# EAGLE design TinyGlo (EAGLE 6.5.0)
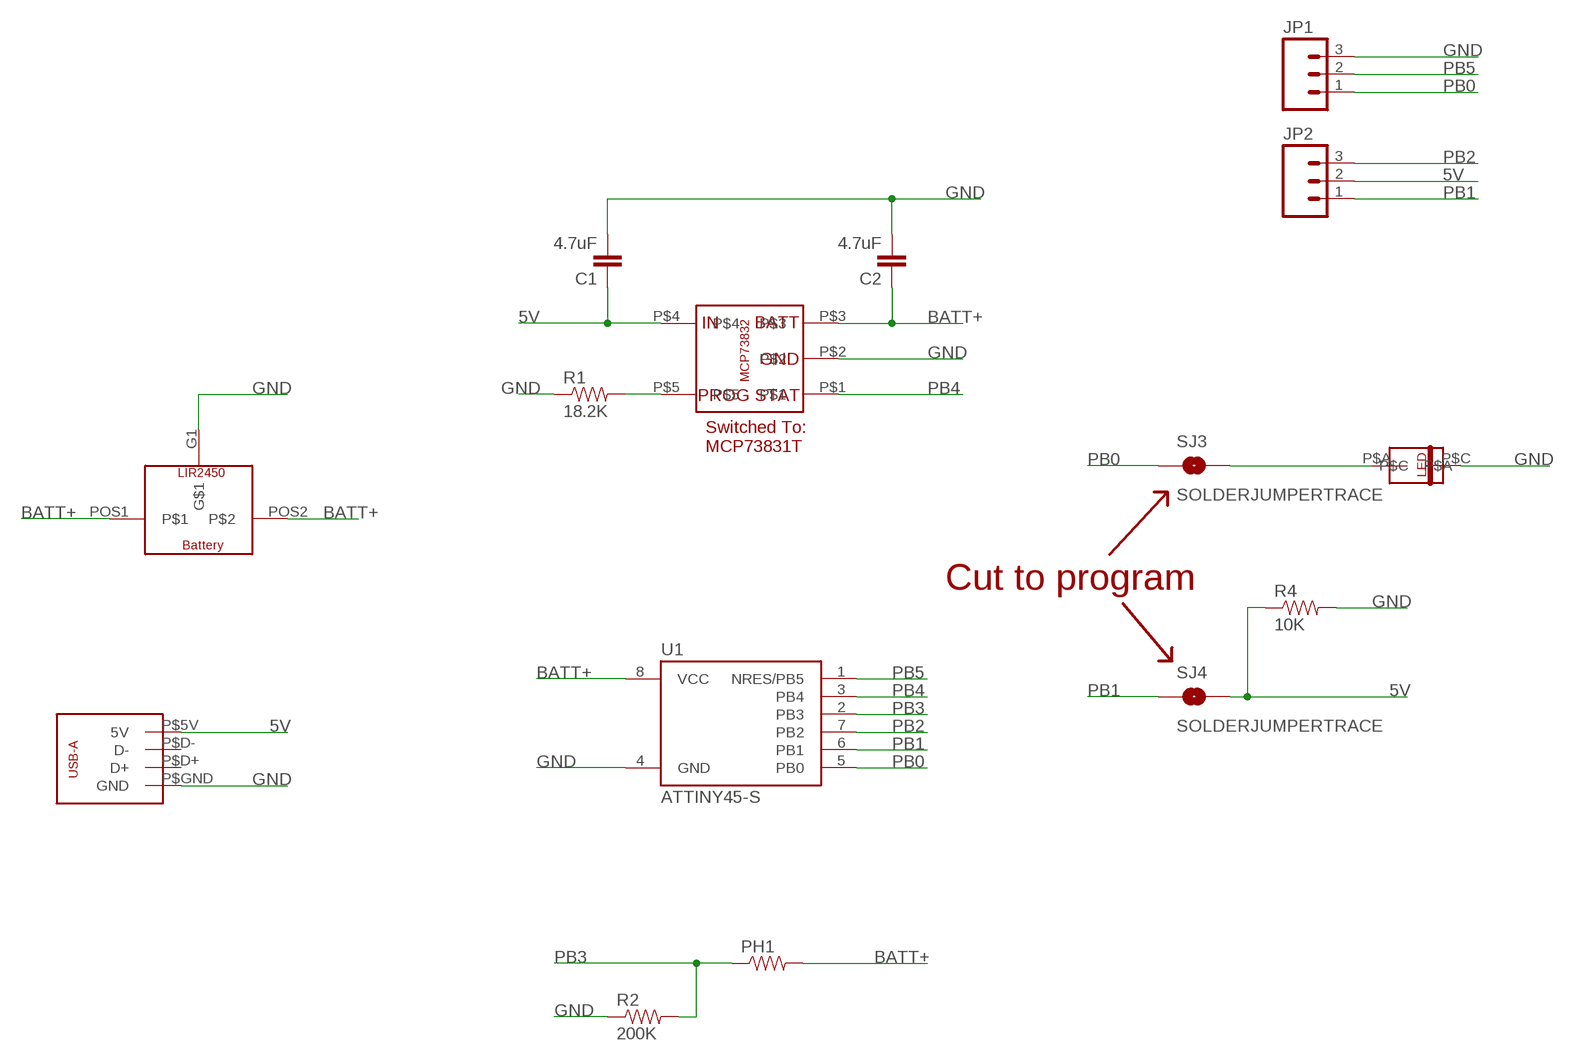
[diagram p0: schematic, sheet 1]

## Parts
C1  4.7uF  CAP0603-CAP  [0603-CAP]
C2  4.7uF  CAP0603-CAP  [0603-CAP]
JP1  M03LOCK  [1X03_LOCK]
JP2  M03LOCK  [1X03_LOCK]
PH1  RESISTOR0805-RES  [0805]
R1  18.2K  RESISTOR0603-RES  [0603-RES]
R2  200K  RESISTOR0603-RES  [0603-RES]
R4  10K  RESISTOR0603-RES  [0603-RES]
SJ3  SOLDERJUMPERTRACE  [SJ_2S-TRACE]
SJ4  SOLDERJUMPERTRACE  [SJ_2S-TRACE]
U1  ATTINY45-S  [SOIC8_EIAJ_208MIL]
U$1  LIPOBATTCHG-MCP73832T-2DFI/OT  [LIPOBATTCHG-MCP73832T-2DFI/OT]
U$2  LIR2450_SMD_BATT_BK-5033  [LIR2450_SMD_BATT_BK-5033]
U$3  USB-A_PCB_TRACES  [USB-A_PCB_TRACES]
U$4  PLCC-2_LED  [PLCC-2_LED]

## Nets
5V: C1.1 JP2.2 R4.1 SJ4.2 U$1.P$4 U$3.P$5V(5V)
BATT+: C2.1 PH1.2 U1.8(VCC) U$1.P$3 U$2.POS1 U$2.POS2
GND: C1.2 C2.2 JP1.3 R1.1 R2.1 R4.2 U1.4(GND) U$1.P$2 U$2.G1(G$1) U$3.P$GND(GND) U$4.P$C
N$1: R1.2 U$1.P$5
N$2: SJ3.2 U$4.P$A
PB0: JP1.1 SJ3.1 U1.5(PB0)
PB1: JP2.1 SJ4.1 U1.6(PB1)
PB2: JP2.3 U1.7(PB2)
PB3: PH1.1 R2.2 U1.2(PB3)
PB4: U1.3(PB4) U$1.P$1
PB5: JP1.2 U1.1(NRES/PB5)
Unconnected: U$3.P$D+(D+) U$3.P$D-(D-)

## Notes on the sheet
- Switched To:
  MCP73831T
- Cut to program

## Library data of the parts
C1 C2 = SparkFun-Capacitors:CAP: Capacitor Standard 0603 ceramic capacitor, and 0.1" leaded capacitor.
JP1 JP2 = SparkFun-Connectors:M03: Header 3 Standard 3-pin 0.1" header. Use with straight break away headers (SKU : PRT-00116), right angle break away headers (PRT-00553), swiss pins (PRT-00743), machine pins (PRT-00117), and female headers (PRT-00115). Molex polarized connector foot print use with SKU : PRT-08232 with associated crimp pins and housings.
PH1 = SparkFun-Resistors:RESISTOR: Resistor Basic schematic elements and footprints for 0603, 1206, and PTH resistors.
R1 R2 R4 = SparkFun-Passives:RESISTOR: Resistor Basic schematic elements and footprints for 0603, 1206, and PTH resistors.
SJ3 SJ4 = SparkFun-Passives:SOLDERJUMPER: Solder Jumper Standard SMD solder jumper. Used to automate production. Two varients : Normally Open and Normally Closed are the same, but have different paste layers. NC will have a large amount of paste and should jumper during reflow.
U1 = _hhn_attiny25_45_85:ATTINY45*: ATMEL ATtiny 45 Packages: P = PDIP 08 30mil S = SOIC 08 EIAJ 208mil X = TSSOP 08 4.4mm Technologies Note: for complete ordering code (temp. range, finish, tape&reel etc.) see www.atmel.com • Supply Voltage: V = (1.8…5.5)V | [blank] = (2.7…5.5)V • Speed: 10 = 10 MHz | 20 = 20 MHz Author: Dipl.-Ing. FH Rainer Bayer HHN Hochschule Heilbronn (Heilbronn University), rainer.bayer@hs-heilbronn.de Ingenieurbüro ing-rb, mail@ing-rb.de
U$1 = JKCustom:LIPOBATTCHG-MCP73832T-2DFI/OT
U$2 = JKCustom:LIR2450_SMD_BATT_BK-5033
U$3 = JKCustom:USB-A_PCB_TRACES
U$4 = JKCustom:PLCC-2_LED

## Board
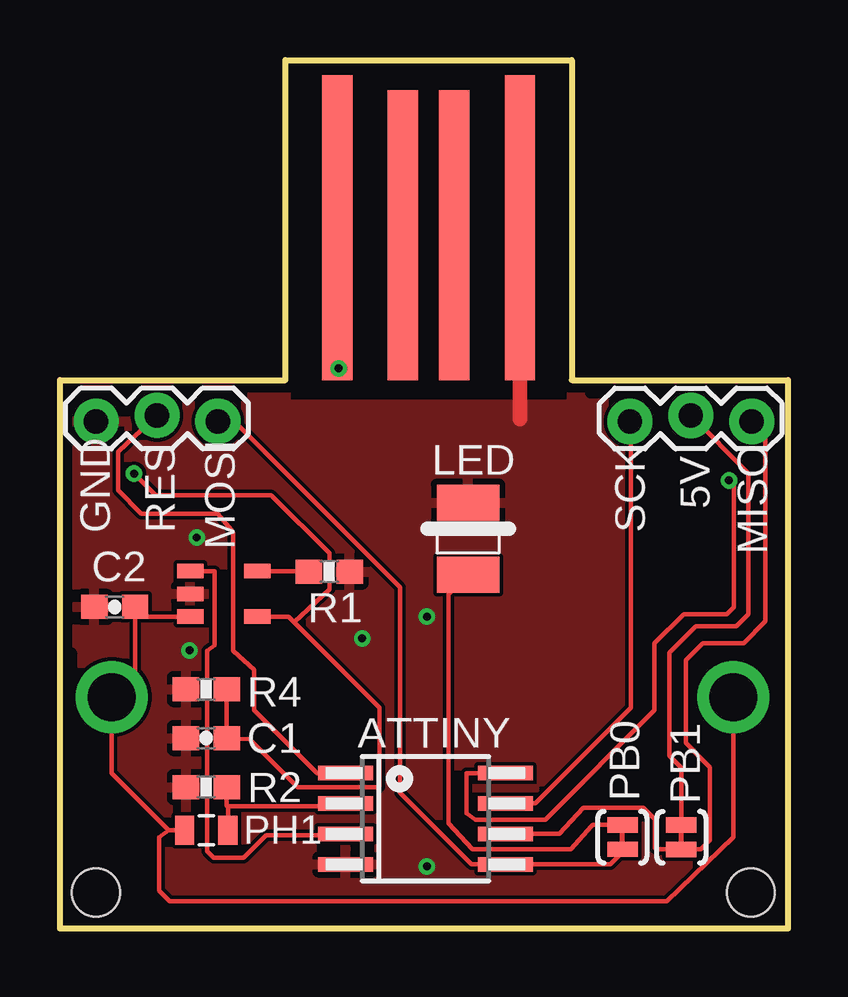
[diagram p1: board, top side]
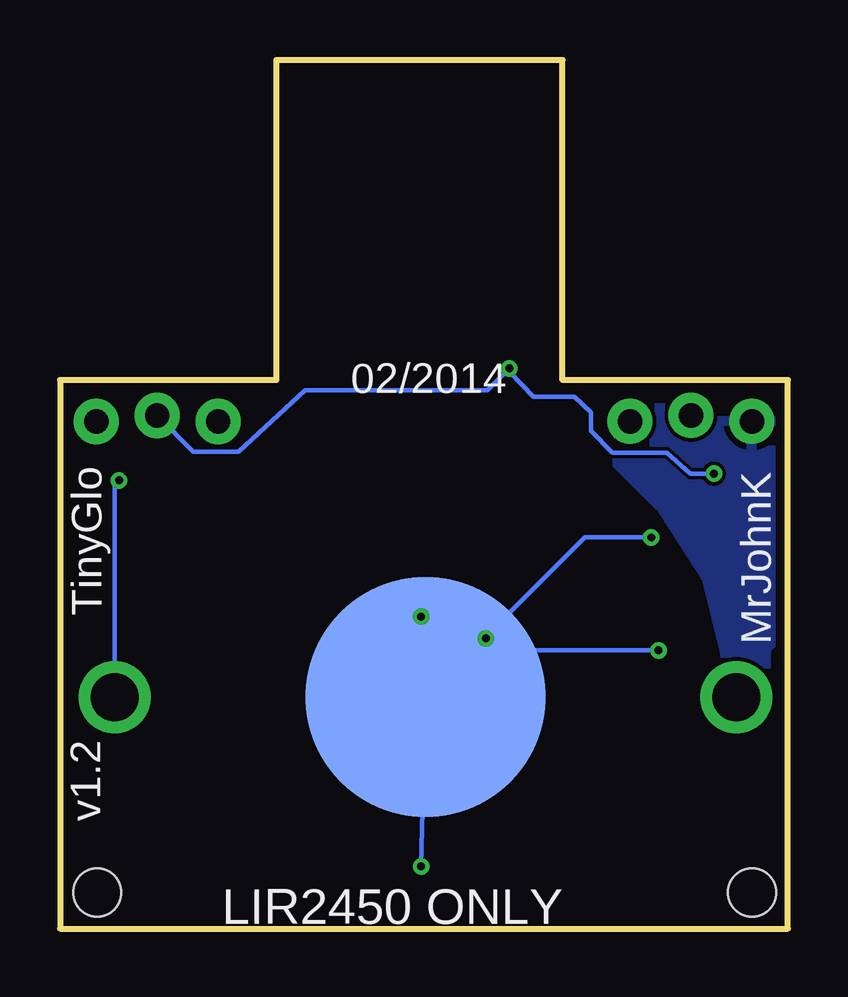
[diagram p2: board, bottom side, seen from below]

Size 30.35 x 36.2 mm. Coordinates in mm from the lower left corner, seen from the top.
Outline: 0,0 0,22.86 9.4,22.86 9.4,36.2 21.34,36.2 21.34,22.86 30.35,22.86 30.35,0 0,0
Copper layers (1*16): Top 0.0356mm / dielectric 1.5011mm / Bottom 0.0356mm
Design rules "LaenPCBOrder_DRC": minimum track width 6mil, minimum drill 13mil, track to track 6mil, track to pad 6mil, pad to pad 6mil, via to via 6mil, smd to smd 6mil, copper to edge 15mil, drill to drill 6mil, minimum pad ring 7mil, minimum via ring 7mil, stop-mask expansion 3mil, vias tented up to drill 0mil, thermal gap 10mil
Holes 2 mm at 1.5,1.5 28.8,1.5
tRestrict: area 29.7,7.5 to 30.3,12.2; area 0,8.4 to 0.5,11.5; area 0,22.2 to 7.6,22.8; area 22.1,22.3 to 30.2,22.8; area 9.5,29.7 to 21.1,36
bRestrict: area 2.8,0.3 to 27.4,21.8; area 0,8.4 to 0.5,11.5; area 29.7,7.5 to 30.3,12.2; area 0,22.1 to 7.6,22.9; area 22.2,22.3 to 30.3,22.8; area 9.5,29.7 to 21.1,36

### Footprints (pad centres in the part's own frame; a part is rotated, then mirrored left to right if it is on the bottom)
0603-CAP = smd 1.1 x 1: 1 -0.85,0; 2 0.85,0
1X03_LOCK = drill 1.016 pad 1.88: 1 0,0.127; 2 2.54,-0.127; 3 5.08,0.127
0805 = smd 0.8 x 1.2: 1 -0.9,0; 2 0.9,0
0603-RES = smd 1.1 x 1: 1 -0.85,0; 2 0.85,0
SJ_2S-TRACE = smd 0.635 x 1.27: 1 -0.508,0; 2 0.508,0
SOIC8_EIAJ_208MIL = smd 0.6 x 2.286: 1 -1.905,-3.33; 2 -0.635,-3.33; 3 0.635,-3.33; 4 1.905,-3.33; 5 1.905,3.33; 6 0.635,3.33; 7 -0.635,3.33; 8 -1.905,3.33
LIPOBATTCHG-MCP73832T-2DFI/OT = smd 0.6 x 1.1: P$1 -0.95,0; P$2 0,0; P$3 0.95,0; P$4 0.95,2.8; P$5 -0.95,2.8
LIR2450_SMD_BATT_BK-5033 = smd 10 x 10: G1 0,0 | drill 2: POS1 -12.95,0; POS2 12.95,0
USB-A_PCB_TRACES = smd 1.27 x 12.7: P$5V -3.81,0; P$GND 3.81,0 | smd 1.27 x 12.065: P$D+ 1.079,-0.318; P$D- -1.079,-0.318
PLCC-2_LED = smd 1.5 x 2.6: P$A -1.5,0; P$C 1.5,0

### Placement (x,y rotation side)
C1  6.1,7.94 180 top
C2  2.29,13.41 180 top
JP1  6.58,21.26 180 top
JP2  28.84,21.26 180 top
PH1  6.1,4.1 180 top
R1  11.23,14.88 180 top
R2  6.1,5.9 0 top
R4  6.1,9.98 180 top
SJ3  23.45,3.81 90 top
SJ4  25.91,3.81 90 top
U1  15.24,4.58 270 top
U$1  5.43,13.95 270 top
U$2  15.11,9.65 0 bottom
U$3  15.37,29.21 0 top
U$4  17.02,16.26 90 top

### Tracks (layer width: path | path; a pad name or v marks a point on that pad's centre or on a via)
5V  (via drill 0.33 pad 0.69)
  Top 0.18: 9.76,12.77 11.24,14.14 11.23,15.64 8.8,18.07 8.7,18.07 3.98,18.07 v3.09,18.96 | 9.76,12.77 13.32,9.21 13.32,5.92 13.3,5.9 9.9,5.9 7.9,7.9 C1.1 R4.1 | v11.62,23.34 11.62,29.15 U$3.P$5V | U$1.P$4 9.54,13 9.76,12.77 | JP2.2 28.7,18.98 28.7,13.1 28.2,12.6 26.5,12.6 25.4,11.5 25.4,7.2 25.9,6.7 SJ4.2
  Bottom 0.18: JP2.2 24.79,19.88 22.9,19.88 20.13,22.45 13.32,22.45 12.52,22.45 v11.62,23.34 11.62,23.2 10.62,22.17 8.9,22.17 8.23,21.52 8.23,20.75 7.31,19.84 5.05,19.84 4.07,18.96 v3.09,18.96
BATT+  (via drill 0.33 pad 0.69)
  Top 0.18: 3.14,13 C2.1 | 3.14,13 3.14,10.62 U$2.POS2 2.16,6.47 4.53,4.1 | 3.14,13 4.61,13 U$1.P$3 | U$2.POS1 28.06,3.8 25.3,1.14 4.57,1.14 4.13,1.57 4.13,3.8 4.53,4.1 | U1.8 16.95,6.49 16.95,4.8 17.31,4.54 20.23,4.54 24.79,9.11 24.79,11.89 26,13.1 27.8,13.1 28.1,13.4 28.1,18.47 v27.89,18.68 | PH1.2 4.53,4.1
  Bottom 0.18: U$2.POS1 28.06,18.51 v27.89,18.68
GND  (via drill 0.33 pad 0.69)
  Top 0.61: 19.18,21.22 U$3.P$GND
  Bottom 0.18: v15.3,13 U$2.G1 | v12.6,12.1 14.67,10.08 | 14.67,10.08 U$2.G1 | v15.3,2.6 U$2.G1 | v5.4,11.6 14.67,11.6 14.67,10.08 | v5.7,16.3 8.46,16.3 U$2.G1
  pour Bottom: 0,0 0,22.86 9.4,22.86 9.4,21.84 21.34,21.84 21.34,22.86 30.48,22.86 30.48,0
  pour Top: 0,0 0,22.86 9.4,22.86 9.4,21.84 21.34,21.84 21.34,22.86 30.48,22.86 30.48,0
N$1
  Top 0.18: U$1.P$5 10.36,14.9 R1.2
N$2
  Top 0.18: U$4.P$A 16.2,13.94 16.2,4.4 17.2,3.3 21.3,3.3 22.16,4.26 22.22,4.32 SJ3.2
PB0
  Top 0.18: JP1.1 7.17,21.24 14.17,14.23 14.17,5.66 17.15,2.68 U1.5 19.27,2.68 22.95,2.68 23.45,3.18 SJ3.1
PB1
  Top 0.18: U1.6 20.82,3.95 21.82,5.05 24.33,5.05 24.8,4.55 24.8,3.36 24.86,3.3 SJ4.1 26.71,3.3 27.1,3.69 27.1,3.9 27.1,6.74 26.81,7.03 26.08,7.75 26.08,11.18 26.8,11.9 28.5,11.9 29.4,12.8 29.4,20.57 JP2.1
PB2
  Top 0.18: U1.7 19.82,5.22 23.8,9.2 23.8,21.19 JP2.3
PB3
  Top 0.18: 7,5.08 PH1.1 | 7,5.08 6.95,5.13 R2.2 | 7,5.08 7.02,5.1 11,5.1 11.12,5.22 U1.2
PB4
  Top 0.18: U$1.P$1 6.45,14.9 6.45,11.8 6.13,11.58 6.13,3.57 6.13,3.22 6.4,2.95 7.65,2.95 8.6,3.9 11.86,3.9 U1.3
PB5
  Top 0.18: U1.1 10.71,6.49 8.1,9.1 8.1,10.79 7.21,11.58 7.21,16.5 7.17,16.6 6.58,17.29 3.39,17.29 2.43,18.26 2.43,19.87 JP1.2

### Text on the board
_tsilk: LED | 5V | GND | RES | MOSI | SCK | MISO | ATTINY | PB0 | PB1
_bsilk: 02/2014 | TinyGlo | MrJohnK | v1.2 | LIR2450 ONLY